# EAGLE schematic New_U540 (EAGLE 9.6.2)
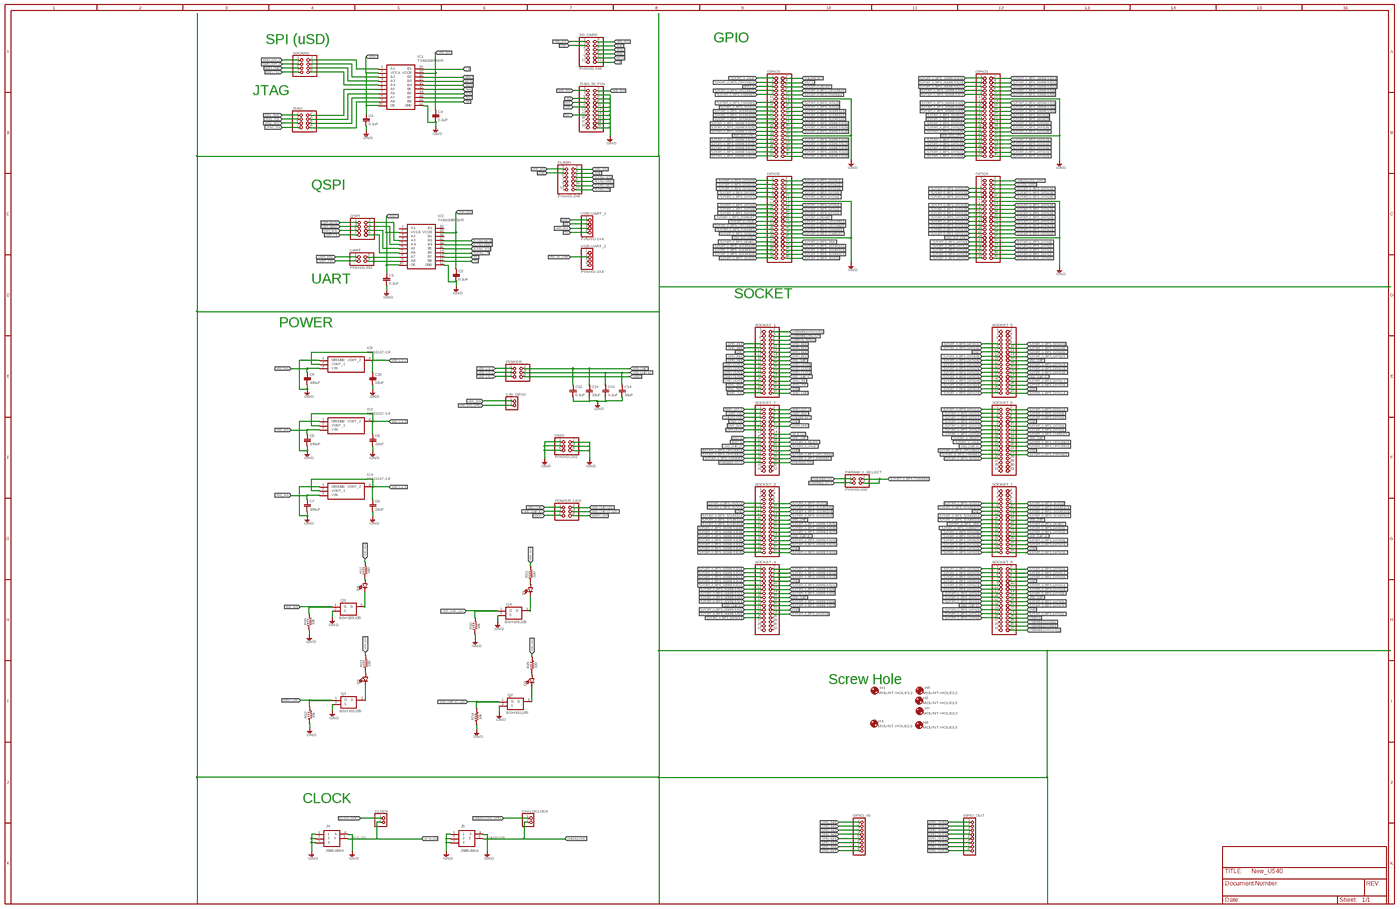
[diagram p0: schematic, sheet 1, overview]
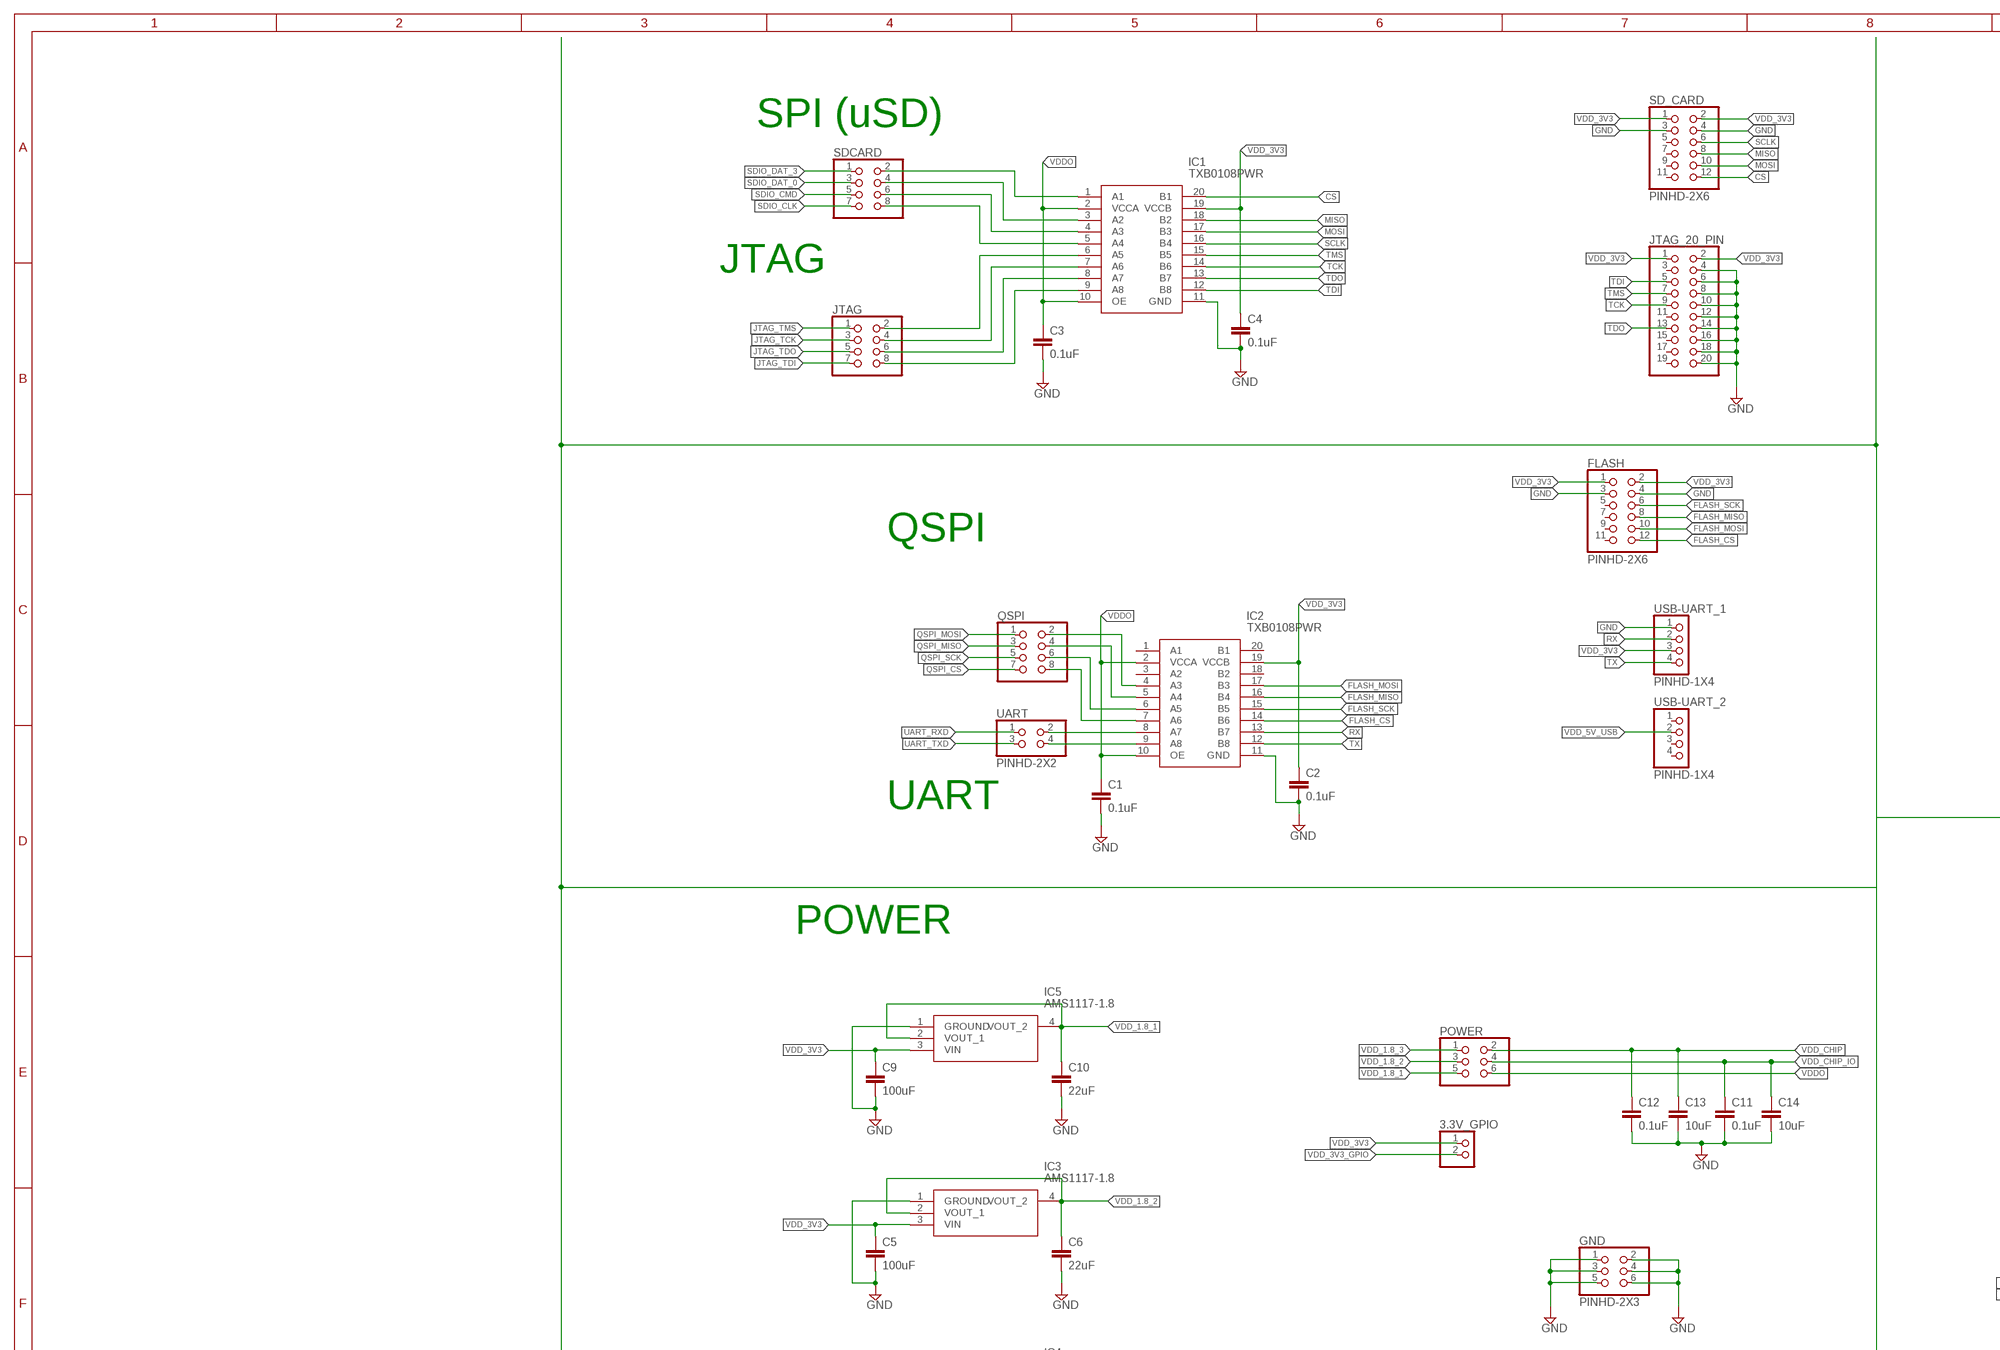
[diagram p1: schematic, sheet 1, part 1 of 4]
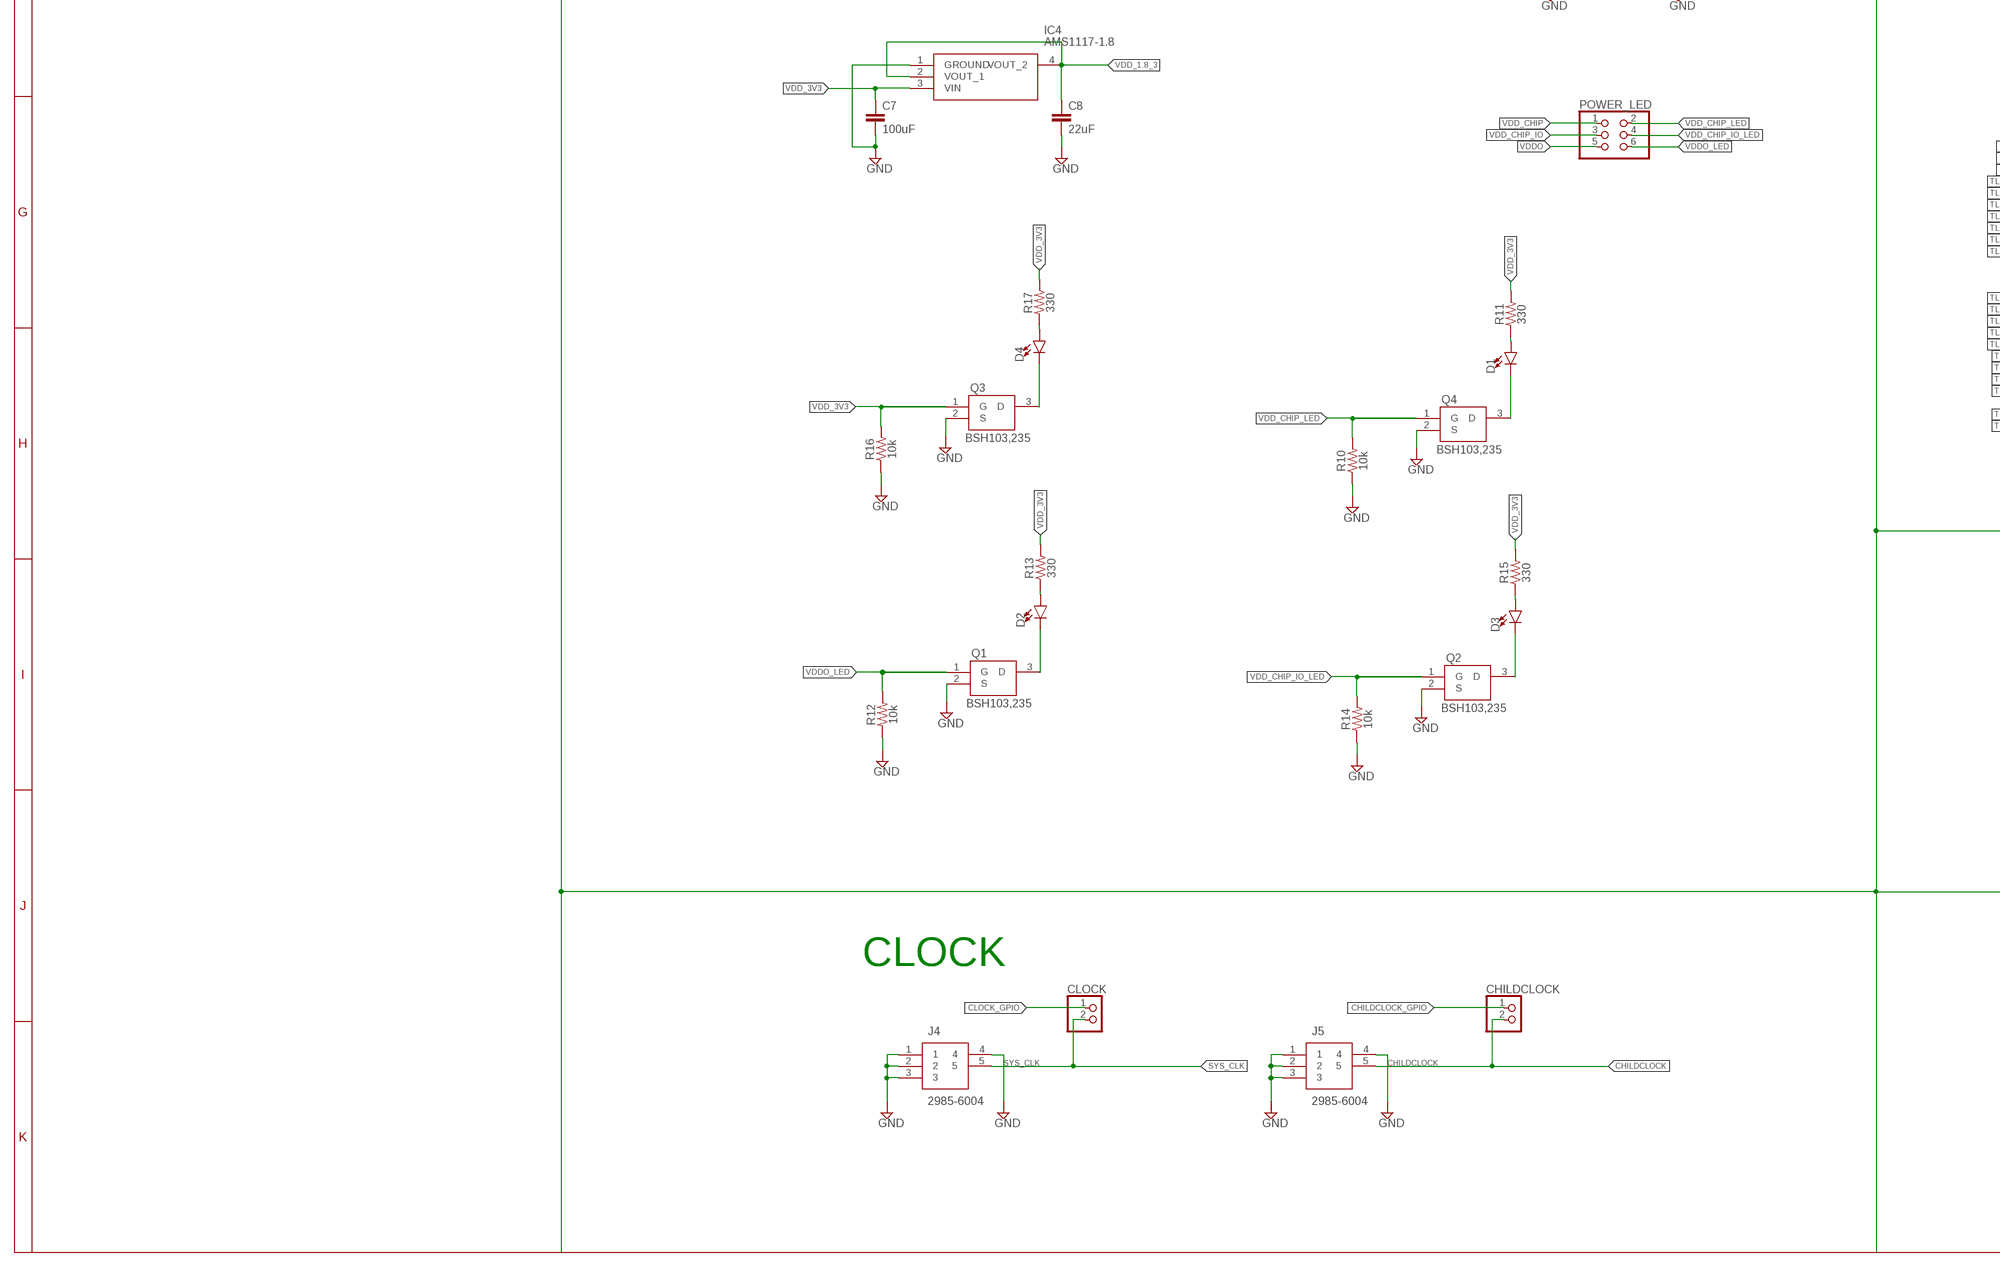
[diagram p2: schematic, sheet 1, part 2 of 4]
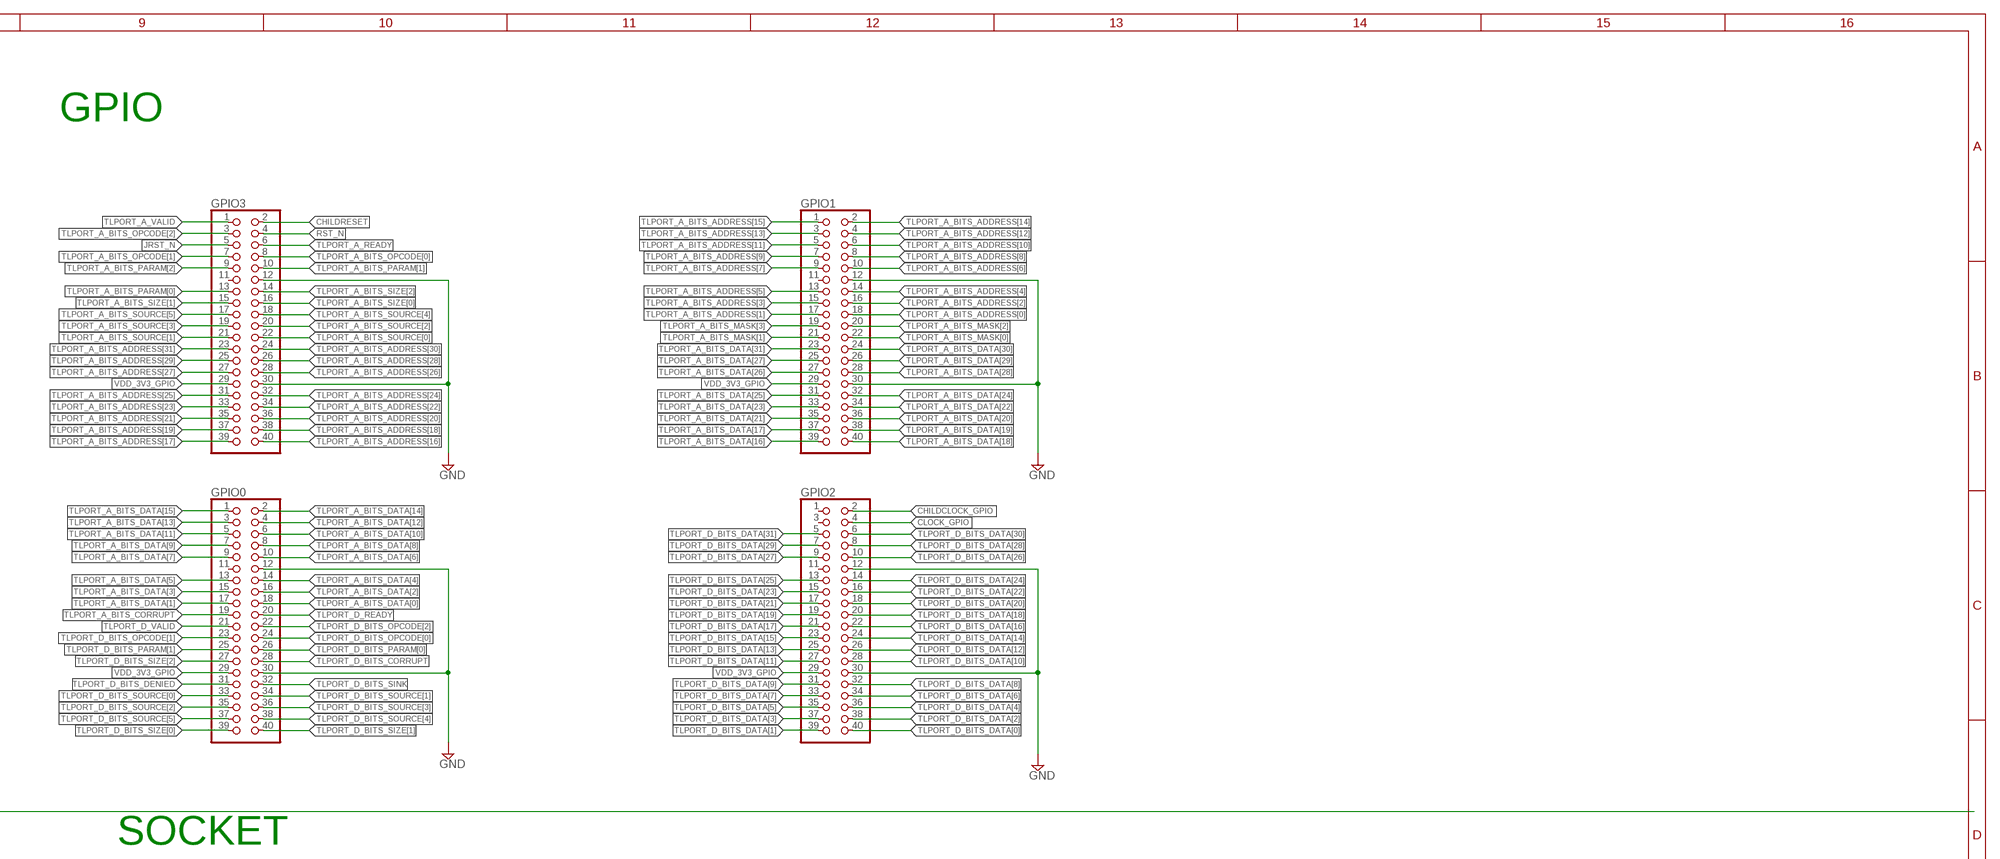
[diagram p3: schematic, sheet 1, part 3 of 4]
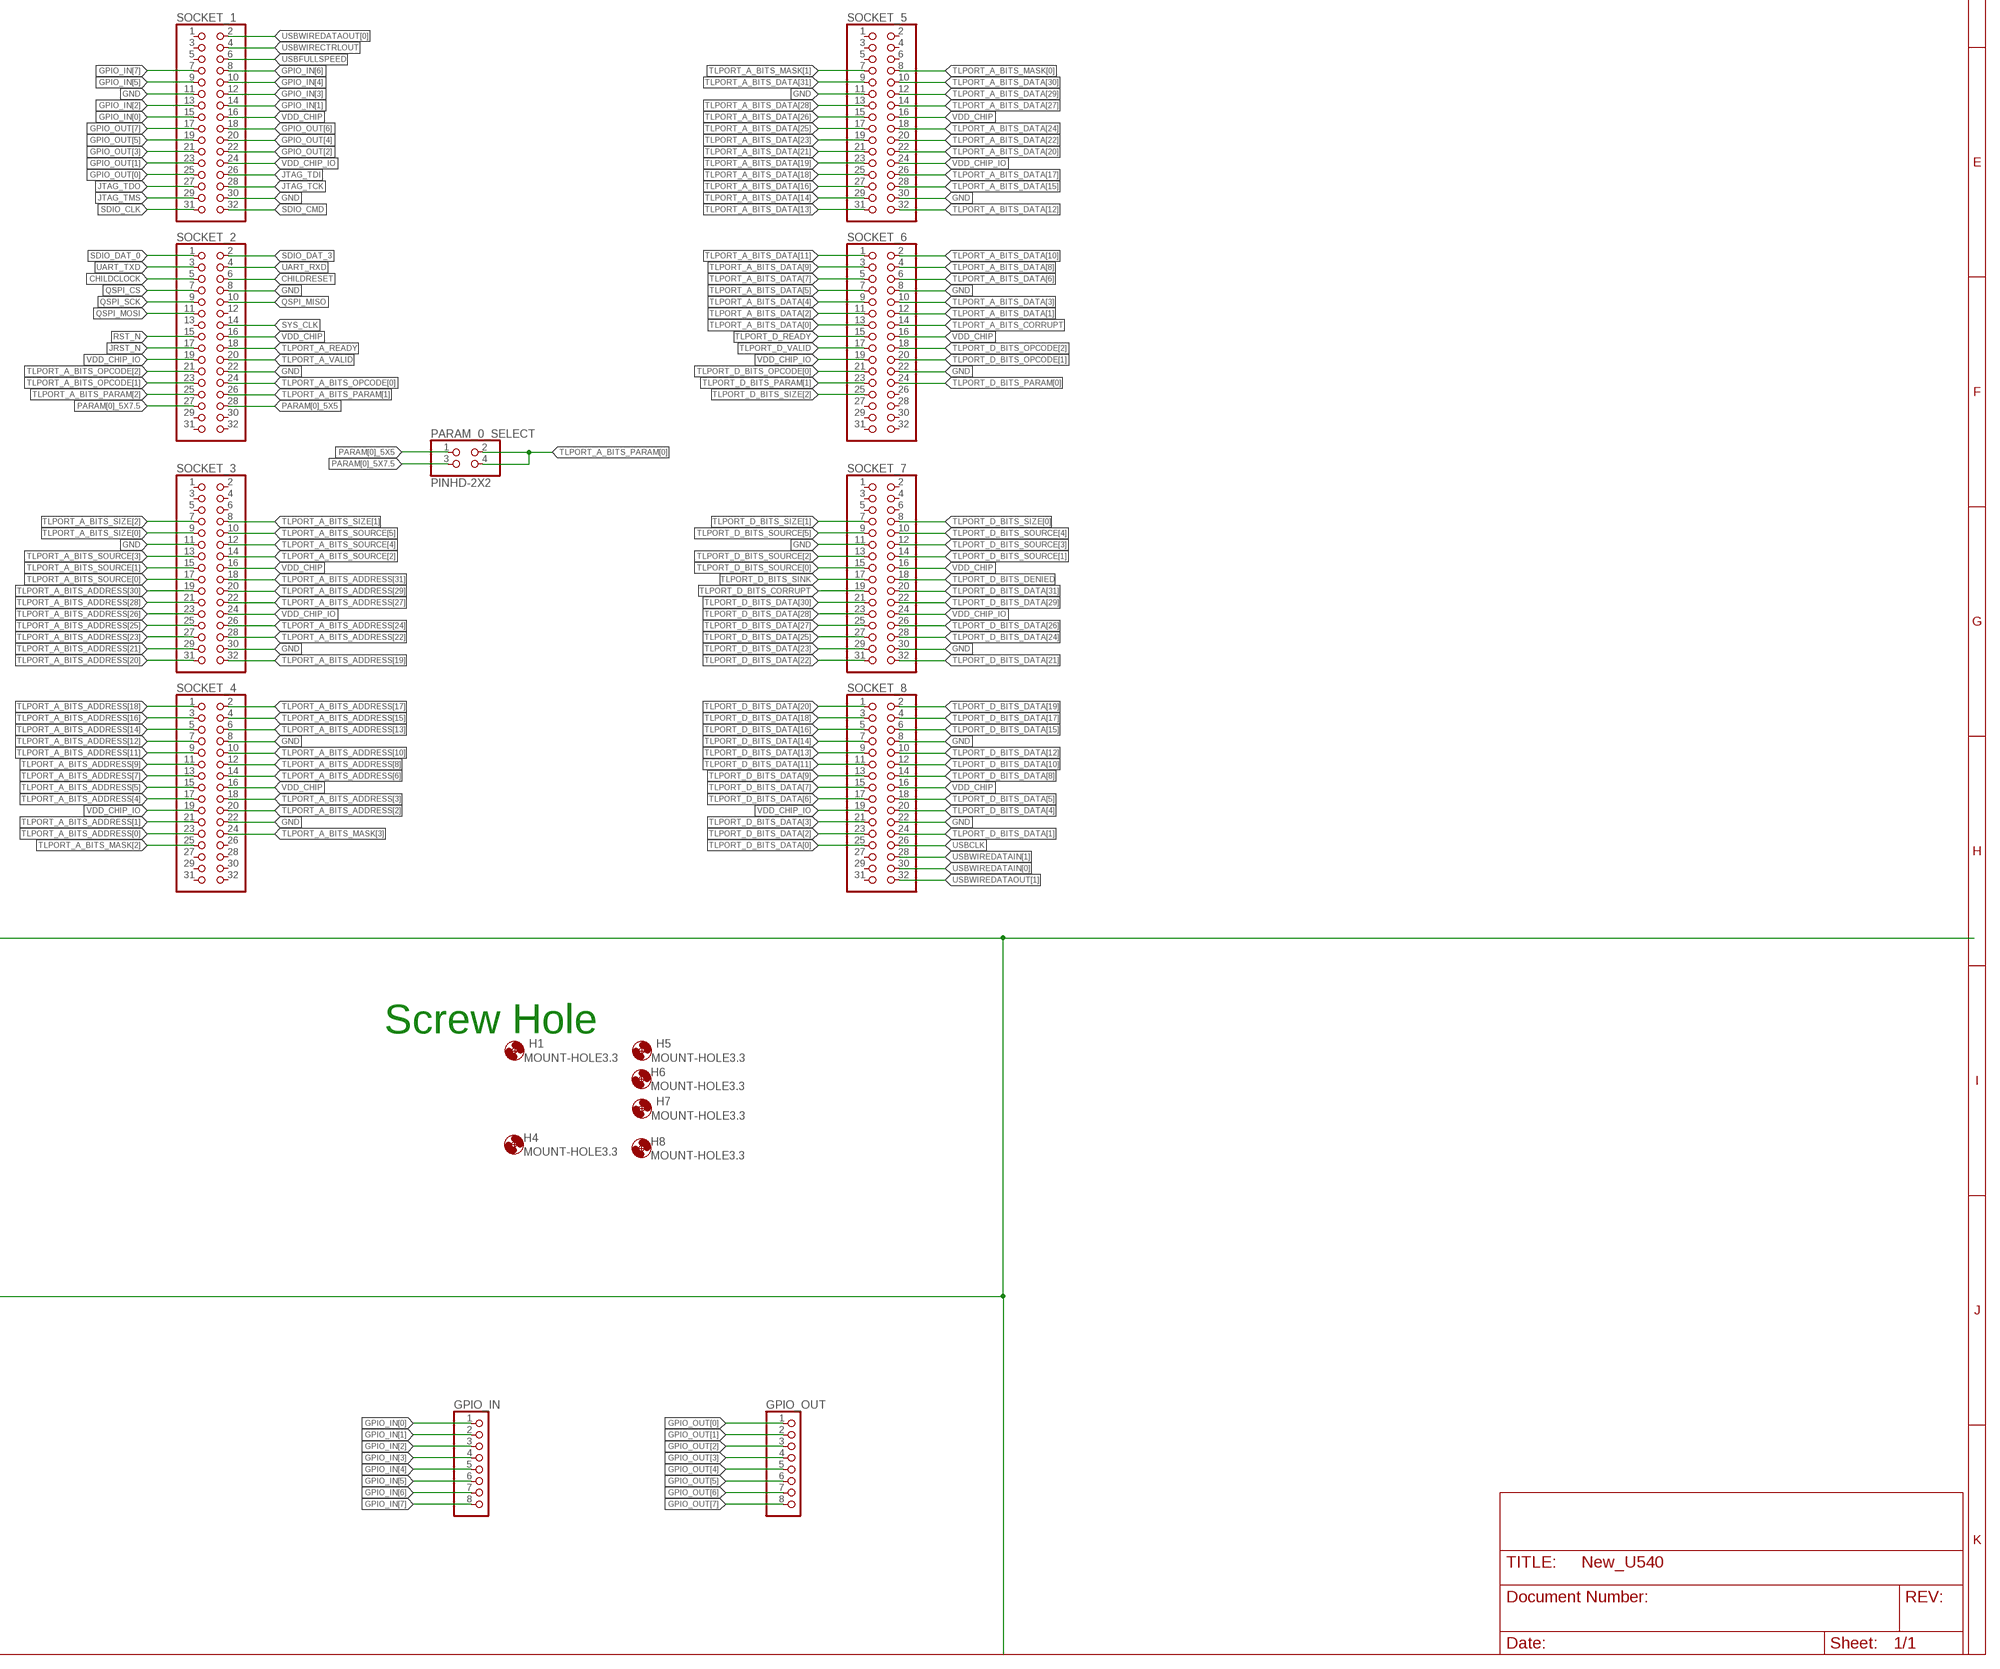
[diagram p4: schematic, sheet 1, part 4 of 4]

## Parts
3.3V_GPIO  PINHD-1X2  [1X02]
C1  0.1uF  1.0UF-1206-50V-10%  [1206]
C2  0.1uF  1.0UF-1206-50V-10%  [1206]
C3  0.1uF  1.0UF-1206-50V-10%  [1206]
C4  0.1uF  1.0UF-1206-50V-10%  [1206]
C5  100uF  1.0UF-1206-50V-10%  [1206]
C6  22uF  1.0UF-1206-50V-10%  [1206]
C7  100uF  1.0UF-1206-50V-10%  [1206]
C8  22uF  1.0UF-1206-50V-10%  [1206]
C9  100uF  1.0UF-1206-50V-10%  [1206]
C10  22uF  1.0UF-1206-50V-10%  [1206]
C11  0.1uF  1.0UF-1206-50V-10%  [1206]
C12  0.1uF  1.0UF-1206-50V-10%  [1206]
C13  10uF  1.0UF-1206-50V-10%  [1206]
C14  10uF  1.0UF-1206-50V-10%  [1206]
CHILDCLOCK  PINHD-1X2  [1X02]
CLOCK  PINHD-1X2  [1X02]
D1  LED1206  [LED-1206]
D2  LED1206  [LED-1206]
D3  LED1206  [LED-1206]
D4  LED1206  [LED-1206]
FLASH  PINHD-2X6  [2X06]
GND  PINHD-2X3  [2X03]
GPIO0  PINHD-2X20  [2X20]
GPIO1  PINHD-2X20  [2X20]
GPIO2  PINHD-2X20  [2X20]
GPIO3  PINHD-2X20  [2X20]
GPIO_IN  PINHD-1X8  [1X08]
GPIO_OUT  PINHD-1X8  [1X08]
H1  MOUNT-HOLE3.3  [3,3]
H4  MOUNT-HOLE3.3  [3,3]
H5  MOUNT-HOLE3.3  [3,3]
H6  MOUNT-HOLE3.3  [3,3]
H7  MOUNT-HOLE3.3  [3,3]
H8  MOUNT-HOLE3.3  [3,3]
IC1  TXB0108PWR  [SOP65P640X120-20N]
IC2  TXB0108PWR  [SOP65P640X120-20N]
IC3  AMS1117-1.8  AMS1117  [SOT229P700X180-4N]
IC4  AMS1117-1.8  AMS1117  [SOT229P700X180-4N]
IC5  AMS1117-1.8  AMS1117  [SOT229P700X180-4N]
J4  2985-6004  [29856004]
J5  2985-6004  [29856004]
JTAG  PINHD-2X4  [2X04]
JTAG_20_PIN  PINHD-2X10  [2X10]
PARAM_0_SELECT  PINHD-2X2  [2X02]
POWER  PINHD-2X3  [2X03]
POWER_LED  PINHD-2X3  [2X03]
Q1  BSH103,235  [SOT95P230X110-3N]
Q2  BSH103,235  [SOT95P230X110-3N]
Q3  BSH103,235  [SOT95P230X110-3N]
Q4  BSH103,235  [SOT95P230X110-3N]
QSPI  PINHD-2X4  [2X04]
R10  10k  RESISTOR1206  [1206]
R11  330  RESISTOR1206  [1206]
R12  10k  RESISTOR1206  [1206]
R13  330  RESISTOR1206  [1206]
R14  10k  RESISTOR1206  [1206]
R15  330  RESISTOR1206  [1206]
R16  10k  RESISTOR1206  [1206]
R17  330  RESISTOR1206  [1206]
SD_CARD  PINHD-2X6  [2X06]
SDCARD  PINHD-2X4  [2X04]
SOCKET_1  PINHD-2X16  [2X16]
SOCKET_2  PINHD-2X16  [2X16]
SOCKET_3  PINHD-2X16  [2X16]
SOCKET_4  PINHD-2X16  [2X16]
SOCKET_5  PINHD-2X16  [2X16]
SOCKET_6  PINHD-2X16  [2X16]
SOCKET_7  PINHD-2X16  [2X16]
SOCKET_8  PINHD-2X16  [2X16]
UART  PINHD-2X2  [2X02]
USB-UART_1  PINHD-1X4  [1X04]
USB-UART_2  PINHD-1X4  [1X04]

## Nets
CHILDCLOCK: CHILDCLOCK.2 J5.5 SOCKET_2.5
CHILDCLOCK_GPIO: CHILDCLOCK.1 GPIO2.2
CHILDRESET: GPIO3.2 SOCKET_2.6
CLOCK_GPIO: CLOCK.1 GPIO2.4
CS: IC1.20(B1) SD_CARD.12
FLASH_CS: FLASH.12 IC2.14(B6)
FLASH_MISO: FLASH.8 IC2.16(B4)
FLASH_MOSI: FLASH.10 IC2.17(B3)
FLASH_SCK: FLASH.6 IC2.15(B5)
GND: C1.2 C2.2 C3.2 C4.2 C5.2 C6.2 C7.2 C8.2 C9.2 C10.2 C11.2 C12.2 C13.2 C14.2 FLASH.3 FLASH.4 GND.1 GND.2 GND.3 GND.4 GND.5 GND.6 GPIO0.12 GPIO0.30 GPIO1.12 GPIO1.30 GPIO2.12 GPIO2.30 GPIO3.12 GPIO3.30 IC1.11(GND) IC2.11(GND) IC3.1(GROUND) IC4.1(GROUND) IC5.1(GROUND) J4.1 J4.2 J4.3 J4.4 J5.1 J5.2 J5.3 J5.4 JTAG_20_PIN.4 JTAG_20_PIN.6 JTAG_20_PIN.8 JTAG_20_PIN.10 JTAG_20_PIN.12 JTAG_20_PIN.14 JTAG_20_PIN.16 JTAG_20_PIN.18 JTAG_20_PIN.20 Q1.2(S) Q2.2(S) Q3.2(S) Q4.2(S) R10.1 R12.1 R14.1 R16.1 SD_CARD.3 SD_CARD.4 SOCKET_1.11 SOCKET_1.30 SOCKET_2.8 SOCKET_2.22 SOCKET_3.11 SOCKET_3.30 SOCKET_4.8 SOCKET_4.22 SOCKET_5.11 SOCKET_5.30 SOCKET_6.8 SOCKET_6.22 SOCKET_7.11 SOCKET_7.30 SOCKET_8.8 SOCKET_8.22 USB-UART_1.1
GPIO_IN[0]: GPIO_IN.1 SOCKET_1.15
GPIO_IN[1]: GPIO_IN.2 SOCKET_1.14
GPIO_IN[2]: GPIO_IN.3 SOCKET_1.13
GPIO_IN[3]: GPIO_IN.4 SOCKET_1.12
GPIO_IN[4]: GPIO_IN.5 SOCKET_1.10
GPIO_IN[5]: GPIO_IN.6 SOCKET_1.9
GPIO_IN[6]: GPIO_IN.7 SOCKET_1.8
GPIO_IN[7]: GPIO_IN.8 SOCKET_1.7
GPIO_OUT[0]: GPIO_OUT.1 SOCKET_1.25
GPIO_OUT[1]: GPIO_OUT.2 SOCKET_1.23
GPIO_OUT[2]: GPIO_OUT.3 SOCKET_1.22
GPIO_OUT[3]: GPIO_OUT.4 SOCKET_1.21
GPIO_OUT[4]: GPIO_OUT.5 SOCKET_1.20
GPIO_OUT[5]: GPIO_OUT.6 SOCKET_1.19
GPIO_OUT[6]: GPIO_OUT.7 SOCKET_1.18
GPIO_OUT[7]: GPIO_OUT.8 SOCKET_1.17
JRST_N: GPIO3.5 SOCKET_2.17
JTAG_TCK: JTAG.3 SOCKET_1.28
JTAG_TDI: JTAG.7 SOCKET_1.26
JTAG_TDO: JTAG.5 SOCKET_1.27
JTAG_TMS: JTAG.1 SOCKET_1.29
MISO: IC1.18(B2) SD_CARD.8
MOSI: IC1.17(B3) SD_CARD.10
N$1: IC1.1(A1) SDCARD.2
N$2: IC1.3(A2) SDCARD.4
N$3: IC1.4(A3) SDCARD.6
N$5: IC1.5(A4) SDCARD.8
N$6: IC2.9(A8) UART.4
N$7: IC2.8(A7) UART.2
N$8: IC1.9(A8) JTAG.8
N$9: IC1.8(A7) JTAG.6
N$10: IC1.7(A6) JTAG.4
N$11: IC1.6(A5) JTAG.2
N$12: IC2.7(A6) QSPI.8
N$13: IC2.6(A5) QSPI.6
N$14: IC2.5(A4) QSPI.4
N$15: IC2.4(A3) QSPI.2
N$22: D1.A R11.1
N$23: D2.A R13.1
N$24: D1.C Q4.3(D)
N$25: D2.C Q1.3(D)
N$27: D3.A R15.1
N$29: D3.C Q2.3(D)
N$30: D4.A R17.1
N$31: D4.C Q3.3(D)
PARAM[0]_5X5: PARAM_0_SELECT.1 SOCKET_2.28
PARAM[0]_5X7.5: PARAM_0_SELECT.3 SOCKET_2.27
QSPI_CS: QSPI.7 SOCKET_2.7
QSPI_MISO: QSPI.3 SOCKET_2.10
QSPI_MOSI: QSPI.1 SOCKET_2.11
QSPI_SCK: QSPI.5 SOCKET_2.9
RST_N: GPIO3.4 SOCKET_2.15
RX: IC2.13(B7) USB-UART_1.2
SCLK: IC1.16(B4) SD_CARD.6
SDIO_CLK: SDCARD.7 SOCKET_1.31
SDIO_CMD: SDCARD.5 SOCKET_1.32
SDIO_DAT_0: SDCARD.3 SOCKET_2.1
SDIO_DAT_3: SDCARD.1 SOCKET_2.2
SYS_CLK: CLOCK.2 J4.5 SOCKET_2.14
TCK: IC1.14(B6) JTAG_20_PIN.9
TDI: IC1.12(B8) JTAG_20_PIN.5
TDO: IC1.13(B7) JTAG_20_PIN.13
TLPORT_A_BITS_ADDRESS[0]: GPIO1.18 SOCKET_4.23
TLPORT_A_BITS_ADDRESS[1]: GPIO1.17 SOCKET_4.21
TLPORT_A_BITS_ADDRESS[2]: GPIO1.16 SOCKET_4.20
TLPORT_A_BITS_ADDRESS[3]: GPIO1.15 SOCKET_4.18
TLPORT_A_BITS_ADDRESS[4]: GPIO1.14 SOCKET_4.17
TLPORT_A_BITS_ADDRESS[5]: GPIO1.13 SOCKET_4.15
TLPORT_A_BITS_ADDRESS[6]: GPIO1.10 SOCKET_4.14
TLPORT_A_BITS_ADDRESS[7]: GPIO1.9 SOCKET_4.13
TLPORT_A_BITS_ADDRESS[8]: GPIO1.8 SOCKET_4.12
TLPORT_A_BITS_ADDRESS[9]: GPIO1.7 SOCKET_4.11
TLPORT_A_BITS_ADDRESS[10]: GPIO1.6 SOCKET_4.10
TLPORT_A_BITS_ADDRESS[11]: GPIO1.5 SOCKET_4.9
TLPORT_A_BITS_ADDRESS[12]: GPIO1.4 SOCKET_4.7
TLPORT_A_BITS_ADDRESS[13]: GPIO1.3 SOCKET_4.6
TLPORT_A_BITS_ADDRESS[14]: GPIO1.2 SOCKET_4.5
TLPORT_A_BITS_ADDRESS[15]: GPIO1.1 SOCKET_4.4
TLPORT_A_BITS_ADDRESS[16]: GPIO3.40 SOCKET_4.3
TLPORT_A_BITS_ADDRESS[17]: GPIO3.39 SOCKET_4.2
TLPORT_A_BITS_ADDRESS[18]: GPIO3.38 SOCKET_4.1
TLPORT_A_BITS_ADDRESS[19]: GPIO3.37 SOCKET_3.32
TLPORT_A_BITS_ADDRESS[20]: GPIO3.36 SOCKET_3.31
TLPORT_A_BITS_ADDRESS[21]: GPIO3.35 SOCKET_3.29
TLPORT_A_BITS_ADDRESS[22]: GPIO3.34 SOCKET_3.28
TLPORT_A_BITS_ADDRESS[23]: GPIO3.33 SOCKET_3.27
TLPORT_A_BITS_ADDRESS[24]: GPIO3.32 SOCKET_3.26
TLPORT_A_BITS_ADDRESS[25]: GPIO3.31 SOCKET_3.25
TLPORT_A_BITS_ADDRESS[26]: GPIO3.28 SOCKET_3.23
TLPORT_A_BITS_ADDRESS[27]: GPIO3.27 SOCKET_3.22
TLPORT_A_BITS_ADDRESS[28]: GPIO3.26 SOCKET_3.21
TLPORT_A_BITS_ADDRESS[29]: GPIO3.25 SOCKET_3.20
TLPORT_A_BITS_ADDRESS[30]: GPIO3.24 SOCKET_3.19
TLPORT_A_BITS_ADDRESS[31]: GPIO3.23 SOCKET_3.18
TLPORT_A_BITS_CORRUPT: GPIO0.19 SOCKET_6.14
TLPORT_A_BITS_DATA[0]: GPIO0.18 SOCKET_6.13
TLPORT_A_BITS_DATA[1]: GPIO0.17 SOCKET_6.12
TLPORT_A_BITS_DATA[2]: GPIO0.16 SOCKET_6.11
TLPORT_A_BITS_DATA[3]: GPIO0.15 SOCKET_6.10
TLPORT_A_BITS_DATA[4]: GPIO0.14 SOCKET_6.9
TLPORT_A_BITS_DATA[5]: GPIO0.13 SOCKET_6.7
TLPORT_A_BITS_DATA[6]: GPIO0.10 SOCKET_6.6
TLPORT_A_BITS_DATA[7]: GPIO0.9 SOCKET_6.5
TLPORT_A_BITS_DATA[8]: GPIO0.8 SOCKET_6.4
TLPORT_A_BITS_DATA[9]: GPIO0.7 SOCKET_6.3
TLPORT_A_BITS_DATA[10]: GPIO0.6 SOCKET_6.2
TLPORT_A_BITS_DATA[11]: GPIO0.5 SOCKET_6.1
TLPORT_A_BITS_DATA[12]: GPIO0.4 SOCKET_5.32
TLPORT_A_BITS_DATA[13]: GPIO0.3 SOCKET_5.31
TLPORT_A_BITS_DATA[14]: GPIO0.2 SOCKET_5.29
TLPORT_A_BITS_DATA[15]: GPIO0.1 SOCKET_5.28
TLPORT_A_BITS_DATA[16]: GPIO1.39 SOCKET_5.27
TLPORT_A_BITS_DATA[17]: GPIO1.37 SOCKET_5.26
TLPORT_A_BITS_DATA[18]: GPIO1.40 SOCKET_5.25
TLPORT_A_BITS_DATA[19]: GPIO1.38 SOCKET_5.23
TLPORT_A_BITS_DATA[20]: GPIO1.36 SOCKET_5.22
TLPORT_A_BITS_DATA[21]: GPIO1.35 SOCKET_5.21
TLPORT_A_BITS_DATA[22]: GPIO1.34 SOCKET_5.20
TLPORT_A_BITS_DATA[23]: GPIO1.33 SOCKET_5.19
TLPORT_A_BITS_DATA[24]: GPIO1.32 SOCKET_5.18
TLPORT_A_BITS_DATA[25]: GPIO1.31 SOCKET_5.17
TLPORT_A_BITS_DATA[26]: GPIO1.27 SOCKET_5.15
TLPORT_A_BITS_DATA[27]: GPIO1.25 SOCKET_5.14
TLPORT_A_BITS_DATA[28]: GPIO1.28 SOCKET_5.13
TLPORT_A_BITS_DATA[29]: GPIO1.26 SOCKET_5.12
TLPORT_A_BITS_DATA[30]: GPIO1.24 SOCKET_5.10
TLPORT_A_BITS_DATA[31]: GPIO1.23 SOCKET_5.9
TLPORT_A_BITS_MASK[0]: GPIO1.22 SOCKET_5.8
TLPORT_A_BITS_MASK[1]: GPIO1.21 SOCKET_5.7
TLPORT_A_BITS_MASK[2]: GPIO1.20 SOCKET_4.25
TLPORT_A_BITS_MASK[3]: GPIO1.19 SOCKET_4.24
TLPORT_A_BITS_OPCODE[0]: GPIO3.8 SOCKET_2.24
TLPORT_A_BITS_OPCODE[1]: GPIO3.7 SOCKET_2.23
TLPORT_A_BITS_OPCODE[2]: GPIO3.3 SOCKET_2.21
TLPORT_A_BITS_PARAM[0]: GPIO3.13 PARAM_0_SELECT.2 PARAM_0_SELECT.4
TLPORT_A_BITS_PARAM[1]: GPIO3.10 SOCKET_2.26
TLPORT_A_BITS_PARAM[2]: GPIO3.9 SOCKET_2.25
TLPORT_A_BITS_SIZE[0]: GPIO3.16 SOCKET_3.9
TLPORT_A_BITS_SIZE[1]: GPIO3.15 SOCKET_3.8
TLPORT_A_BITS_SIZE[2]: GPIO3.14 SOCKET_3.7
TLPORT_A_BITS_SOURCE[0]: GPIO3.22 SOCKET_3.17
TLPORT_A_BITS_SOURCE[1]: GPIO3.21 SOCKET_3.15
TLPORT_A_BITS_SOURCE[2]: GPIO3.20 SOCKET_3.14
TLPORT_A_BITS_SOURCE[3]: GPIO3.19 SOCKET_3.13
TLPORT_A_BITS_SOURCE[4]: GPIO3.18 SOCKET_3.12
TLPORT_A_BITS_SOURCE[5]: GPIO3.17 SOCKET_3.10
TLPORT_A_READY: GPIO3.6 SOCKET_2.18
TLPORT_A_VALID: GPIO3.1 SOCKET_2.20
TLPORT_D_BITS_CORRUPT: GPIO0.28 SOCKET_7.19
TLPORT_D_BITS_DATA[0]: GPIO2.40 SOCKET_8.25
TLPORT_D_BITS_DATA[1]: GPIO2.39 SOCKET_8.24
TLPORT_D_BITS_DATA[2]: GPIO2.38 SOCKET_8.23
TLPORT_D_BITS_DATA[3]: GPIO2.37 SOCKET_8.21
TLPORT_D_BITS_DATA[4]: GPIO2.36 SOCKET_8.20
TLPORT_D_BITS_DATA[5]: GPIO2.35 SOCKET_8.18
TLPORT_D_BITS_DATA[6]: GPIO2.34 SOCKET_8.17
TLPORT_D_BITS_DATA[7]: GPIO2.33 SOCKET_8.15
TLPORT_D_BITS_DATA[8]: GPIO2.32 SOCKET_8.14
TLPORT_D_BITS_DATA[9]: GPIO2.31 SOCKET_8.13
TLPORT_D_BITS_DATA[10]: GPIO2.28 SOCKET_8.12
TLPORT_D_BITS_DATA[11]: GPIO2.27 SOCKET_8.11
TLPORT_D_BITS_DATA[12]: GPIO2.26 SOCKET_8.10
TLPORT_D_BITS_DATA[13]: GPIO2.25 SOCKET_8.9
TLPORT_D_BITS_DATA[14]: GPIO2.24 SOCKET_8.7
TLPORT_D_BITS_DATA[15]: GPIO2.23 SOCKET_8.6
TLPORT_D_BITS_DATA[16]: GPIO2.22 SOCKET_8.5
TLPORT_D_BITS_DATA[17]: GPIO2.21 SOCKET_8.4
TLPORT_D_BITS_DATA[18]: GPIO2.20 SOCKET_8.3
TLPORT_D_BITS_DATA[19]: GPIO2.19 SOCKET_8.2
TLPORT_D_BITS_DATA[20]: GPIO2.18 SOCKET_8.1
TLPORT_D_BITS_DATA[21]: GPIO2.17 SOCKET_7.32
TLPORT_D_BITS_DATA[22]: GPIO2.16 SOCKET_7.31
TLPORT_D_BITS_DATA[23]: GPIO2.15 SOCKET_7.29
TLPORT_D_BITS_DATA[24]: GPIO2.14 SOCKET_7.28
TLPORT_D_BITS_DATA[25]: GPIO2.13 SOCKET_7.27
TLPORT_D_BITS_DATA[26]: GPIO2.10 SOCKET_7.26
TLPORT_D_BITS_DATA[27]: GPIO2.9 SOCKET_7.25
TLPORT_D_BITS_DATA[28]: GPIO2.8 SOCKET_7.23
TLPORT_D_BITS_DATA[29]: GPIO2.7 SOCKET_7.22
TLPORT_D_BITS_DATA[30]: GPIO2.6 SOCKET_7.21
TLPORT_D_BITS_DATA[31]: GPIO2.5 SOCKET_7.20
TLPORT_D_BITS_DENIED: GPIO0.31 SOCKET_7.18
TLPORT_D_BITS_OPCODE[0]: GPIO0.24 SOCKET_6.21
TLPORT_D_BITS_OPCODE[1]: GPIO0.23 SOCKET_6.20
TLPORT_D_BITS_OPCODE[2]: GPIO0.22 SOCKET_6.18
TLPORT_D_BITS_PARAM[0]: GPIO0.26 SOCKET_6.24
TLPORT_D_BITS_PARAM[1]: GPIO0.25 SOCKET_6.23
TLPORT_D_BITS_SINK: GPIO0.32 SOCKET_7.17
TLPORT_D_BITS_SIZE[0]: GPIO0.39 SOCKET_7.8
TLPORT_D_BITS_SIZE[1]: GPIO0.40 SOCKET_7.7
TLPORT_D_BITS_SIZE[2]: GPIO0.27 SOCKET_6.25
TLPORT_D_BITS_SOURCE[0]: GPIO0.33 SOCKET_7.15
TLPORT_D_BITS_SOURCE[1]: GPIO0.34 SOCKET_7.14
TLPORT_D_BITS_SOURCE[2]: GPIO0.35 SOCKET_7.13
TLPORT_D_BITS_SOURCE[3]: GPIO0.36 SOCKET_7.12
TLPORT_D_BITS_SOURCE[4]: GPIO0.38 SOCKET_7.10
TLPORT_D_BITS_SOURCE[5]: GPIO0.37 SOCKET_7.9
TLPORT_D_READY: GPIO0.20 SOCKET_6.15
TLPORT_D_VALID: GPIO0.21 SOCKET_6.17
TMS: IC1.15(B5) JTAG_20_PIN.7
TX: IC2.12(B8) USB-UART_1.4
UART_RXD: SOCKET_2.4 UART.1
UART_TXD: SOCKET_2.3 UART.3
USBCLK: SOCKET_8.26
USBFULLSPEED: SOCKET_1.6
USBWIRECTRLOUT: SOCKET_1.4
USBWIREDATAIN[0]: SOCKET_8.30
USBWIREDATAIN[1]: SOCKET_8.28
USBWIREDATAOUT[0]: SOCKET_1.2
USBWIREDATAOUT[1]: SOCKET_8.32
VDD_1.8_1: C10.1 IC5.2(VOUT_1) IC5.4(VOUT_2) POWER.5
VDD_1.8_2: C6.1 IC3.2(VOUT_1) IC3.4(VOUT_2) POWER.3
VDD_1.8_3: C8.1 IC4.2(VOUT_1) IC4.4(VOUT_2) POWER.1
VDD_3V3: 3.3V_GPIO.1 C2.1 C4.1 C5.1 C7.1 C9.1 FLASH.1 FLASH.2 IC1.19(VCCB) IC2.19(VCCB) IC3.3(VIN) IC4.3(VIN) IC5.3(VIN) JTAG_20_PIN.1 JTAG_20_PIN.2 Q3.1(G) R11.2 R13.2 R15.2 R16.2 R17.2 SD_CARD.1 SD_CARD.2 USB-UART_1.3
VDD_3V3_GPIO: 3.3V_GPIO.2 GPIO0.29 GPIO1.29 GPIO2.29 GPIO3.29
VDD_5V_USB: USB-UART_2.2
VDD_CHIP: C12.1 C13.1 POWER.2 POWER_LED.1 SOCKET_1.16 SOCKET_2.16 SOCKET_3.16 SOCKET_4.16 SOCKET_5.16 SOCKET_6.16 SOCKET_7.16 SOCKET_8.16
VDD_CHIP_IO: C11.1 C14.1 POWER.4 POWER_LED.3 SOCKET_1.24 SOCKET_2.19 SOCKET_3.24 SOCKET_4.19 SOCKET_5.24 SOCKET_6.19 SOCKET_7.24 SOCKET_8.19
VDD_CHIP_IO_LED: POWER_LED.4 Q2.1(G) R14.2
VDD_CHIP_LED: POWER_LED.2 Q4.1(G) R10.2
VDDO: C1.1 C3.1 IC1.2(VCCA) IC1.10(OE) IC2.2(VCCA) IC2.10(OE) POWER.6 POWER_LED.5
VDDO_LED: POWER_LED.6 Q1.1(G) R12.2
Unconnected: FLASH.5 FLASH.7 FLASH.9 FLASH.11 GPIO0.11 GPIO1.11 GPIO2.1 GPIO2.3 GPIO2.11 GPIO3.11 IC2.1(A1) IC2.3(A2) IC2.18(B2) IC2.20(B1) JTAG_20_PIN.3 JTAG_20_PIN.11 JTAG_20_PIN.15 JTAG_20_PIN.17 JTAG_20_PIN.19 SD_CARD.5 SD_CARD.7 SD_CARD.9 SD_CARD.11 SOCKET_1.1 SOCKET_1.3 SOCKET_1.5 SOCKET_2.12 SOCKET_2.13 SOCKET_2.29 SOCKET_2.30 SOCKET_2.31 SOCKET_2.32 SOCKET_3.1 SOCKET_3.2 SOCKET_3.3 SOCKET_3.4 SOCKET_3.5 SOCKET_3.6 SOCKET_4.26 SOCKET_4.27 SOCKET_4.28 SOCKET_4.29 SOCKET_4.30 SOCKET_4.31 SOCKET_4.32 SOCKET_5.1 SOCKET_5.2 SOCKET_5.3 SOCKET_5.4 SOCKET_5.5 SOCKET_5.6 SOCKET_6.26 SOCKET_6.27 SOCKET_6.28 SOCKET_6.29 SOCKET_6.30 SOCKET_6.31 SOCKET_6.32 SOCKET_7.1 SOCKET_7.2 SOCKET_7.3 SOCKET_7.4 SOCKET_7.5 SOCKET_7.6 SOCKET_8.27 SOCKET_8.29 SOCKET_8.31 USB-UART_2.1 USB-UART_2.3 USB-UART_2.4

## Notes on the sheet
- SPI (uSD) | GPIO
- JTAG
- QSPI
- UART
- SOCKET
- POWER
- Screw Hole
- CLOCK

## Library data of the parts
3.3V_GPIO CHILDCLOCK CLOCK = pinhead:PINHD-1X2: PIN HEADER
C1-C14 = SparkFun-Capacitors:1.0UF: 1µF ceramic capacitors A capacitor is a passive two-terminal electrical component used to store electrical energy temporarily in an electric field.; PROD_ID: CAP-09822; VALUE: 1.0uF
D1-D4 = SparkFun-LED:LED: LED (Generic) Standard schematic elements and footprints for 5mm, 3mm, 1206, and 0603 sized LEDs. Generic LEDs with no color specified.
FLASH SD_CARD = Connector:PINHD-2X6: PIN HEADER; CATEGORY: CONNECTOR; SUB-CATEGORY: PIN-HEADER
GND = Connector:PINHD-2X3: PIN HEADER; CATEGORY: CONNECTOR; SUB-CATEGORY: PIN-HEADER
GPIO0 GPIO1-GPIO3 = pinhead:PINHD-2X20: PIN HEADER
GPIO_IN GPIO_OUT = pinhead:PINHD-1X8: PIN HEADER
H1 H4-H8 = holes:MOUNT-HOLE: MOUNTING HOLE with drill center marker
IC1 IC2 = SamacSys_Parts:TXB0108PWR: 8-Bit Bidirectional Voltage-Level Shifter with Auto Direction Sensing and +/-15-kV ESD Protect Source: Datasheet <http://www.ti.com/lit/ds/symlink/txb0108.pdf>; ARROW_PART_NUMBER: TXB0108PWR; ARROW_PRICE-STOCK: https://www.arrow.com/en/products/txb0108pwr/texas-instruments?region=nac; DESCRIPTION: 8-Bit Bidirectional Voltage-Level Shifter with Auto Direction Sensing and +/-15-kV ESD Protect; HEIGHT: 1.2mm; MANUFACTURER_NAME: Texas Instruments; MANUFACTURER_PART_NUMBER: TXB0108PWR; MOUSER_PART_NUMBER: 595-TXB0108PWR; MOUSER_PRICE-STOCK: https://www.mouser.co.uk/ProductDetail/Texas-Instruments/TXB0108PWR?qs=oFXvjAmG9EgEUWGWzOVFCA%3D%3D
IC3-IC5 = SamacSys_Parts:AMS1117: 1117 Source: Datasheet <https://datasheet.lcsc.com/szlcsc/Advanced-Monolithic-Systems-AMS-AMS1117-ADJ_C6188.pdf>; DESCRIPTION: 1117; HEIGHT: 1.8mm; MANUFACTURER_NAME: Advanced Monolithic Systems; MANUFACTURER_PART_NUMBER: AMS1117
J4 J5 = SamacSys_Parts:2985-6004: RF Connectors / Coaxial Connectors SMA F PCB Thru-Hole Conn, 50-OHMS 1000 Source: Datasheet <https://componentsearchengine.com//2985-6004.pdf>; DESCRIPTION: RF Connectors / Coaxial Connectors SMA F PCB Thru-Hole Conn, 50-OHMS 1000; HEIGHT: 9.54mm; MANUFACTURER_NAME: Amphenol; MANUFACTURER_PART_NUMBER: 2985-6004; MOUSER_PART_NUMBER: 523-2985-6004; MOUSER_PRICE-STOCK: https://www.mouser.co.uk/ProductDetail/Amphenol-SV-Microwave/2985-6004?qs=jyo2EwfRkUNkt8LGijRXFQ%3D%3D
JTAG QSPI SDCARD = adafruit:PINHD-2X4: PIN HEADER
JTAG_20_PIN = pinhead:PINHD-2X10: PIN HEADER
PARAM_0_SELECT UART = Connector:PINHD-2X2: PIN HEADER; CATEGORY: CONNECTOR; SUB-CATEGORY: PIN-HEADER
POWER POWER_LED = pinhead:PINHD-2X3: PIN HEADER
Q1-Q4 = SamacSys_Parts:BSH103,235: MOSFET TAPE13 MOSFET Source: Datasheet <http://www.nxp.com/documents/data_sheet/BSH103.pdf>; DESCRIPTION: MOSFET TAPE13 MOSFET; HEIGHT: 1.1mm; MANUFACTURER_NAME: Nexperia; MANUFACTURER_PART_NUMBER: BSH103,235; MOUSER_PART_NUMBER: 771-BSH103235; MOUSER_PRICE-STOCK: https://www.mouser.co.uk/ProductDetail/Nexperia/BSH103235?qs=me8TqzrmIYVhbJIwsR7ziw%3D%3D
R10-R17 = SparkFun-Resistors:RESISTOR: Generic Resistor Package
SOCKET_1-SOCKET_8 = pinhead:PINHD-2X16: PIN HEADER
USB-UART_1 USB-UART_2 = Connector:PINHD-1X4: PIN HEADER; CATEGORY: CONNECTOR; SUB-CATEGORY: PIN-HEADER